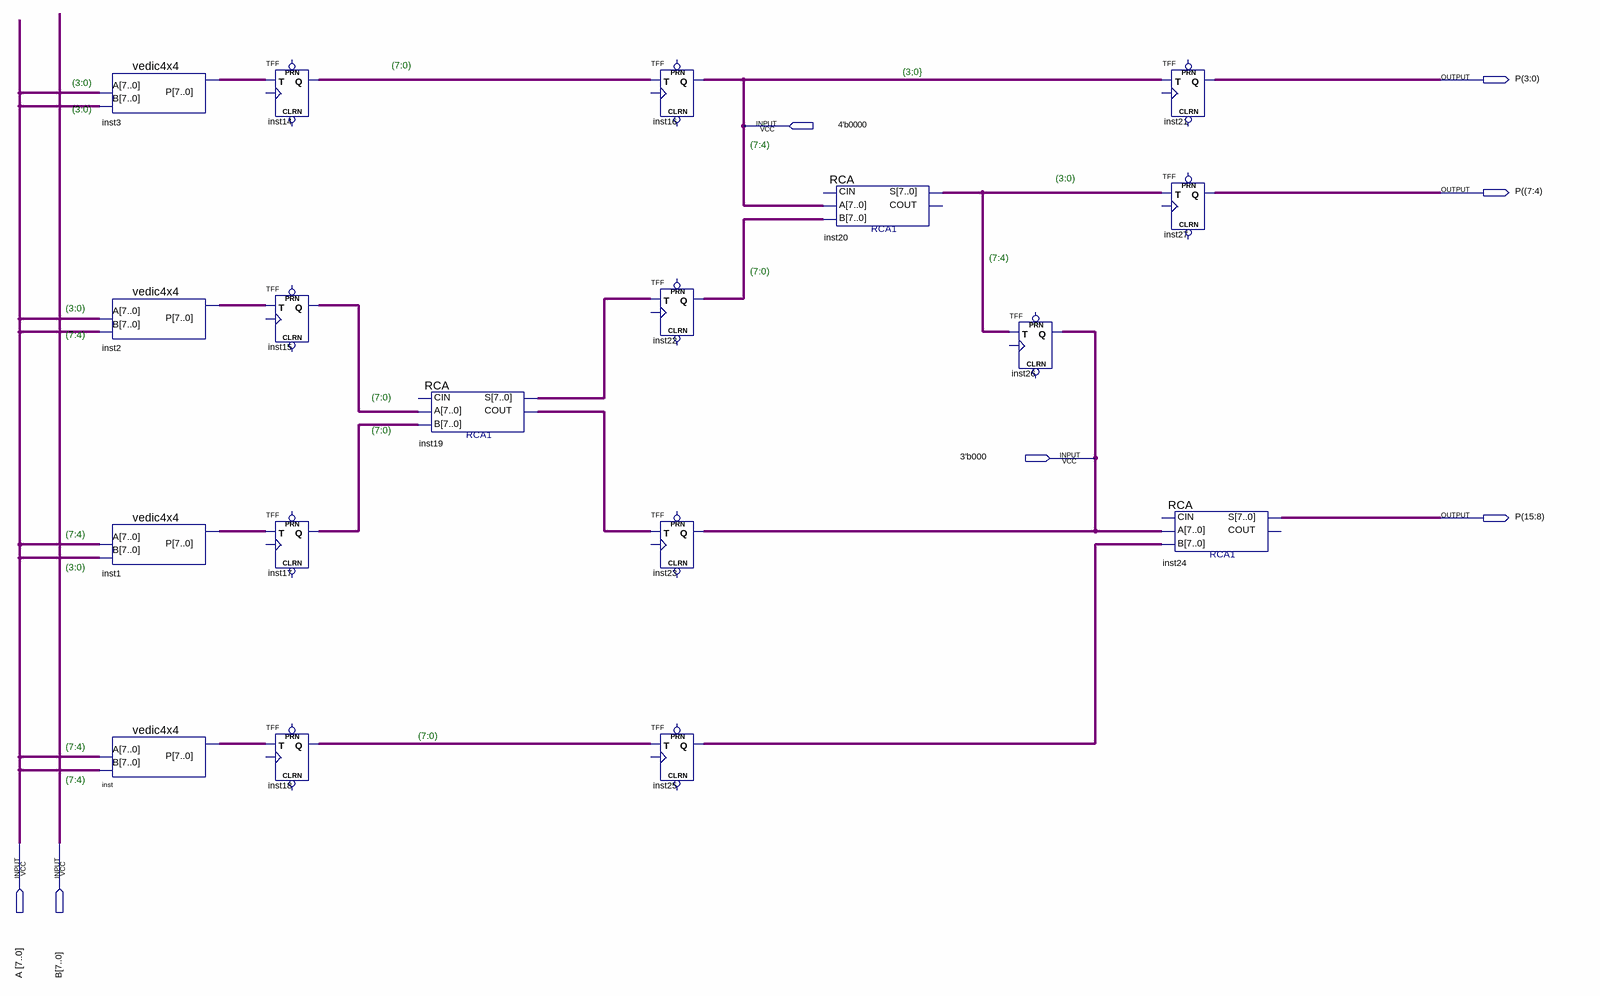
[diagram p0: schematic sheet]
// Quartus schematic schematic top.bdf as structural Verilog: 18 symbols, 7 pins
module \schematic_top  (
  input  \4'b0000 ,
  input  \3'b000 ,
  input  [7:0] A,
  input  [7:0] B,
  output \P(3:0) ,
  output \P((7:4) ,
  output \P(15:8) 
);

  wire [7:0] inst1_sum, inst2_sum, inst3_sum, inst14_q, inst15_q, inst16_q, inst17_q, inst18_q, inst19_cout,
       inst19_sum, inst20_sum, inst21_q, inst22_q, inst23_q, inst24_sum, inst25_q, inst27_q, inst_sum;

  vedic4x4 inst3 (.A(A), .B(A), .SUM(inst3_sum));
  vedic4x4 inst2 (.A(A), .B(A), .SUM(inst2_sum));
  vedic4x4 inst1 (.A(A), .B(A), .SUM(inst1_sum));
  vedic4x4 inst (.A(A), .B(A), .SUM(inst_sum));
  TFF inst14[7:0] (.T(inst3_sum), .Q(inst14_q));  // open: PRN, CLRN, CLK
  TFF inst15[7:0] (.T(inst2_sum), .Q(inst15_q));  // open: PRN, CLRN, CLK
  TFF inst17[7:0] (.T(inst1_sum), .Q(inst17_q));  // open: PRN, CLRN, CLK
  TFF inst18[7:0] (.T(inst_sum), .Q(inst18_q));  // open: PRN, CLRN, CLK
  RCA inst19 (.A(inst15_q), .B(inst17_q), .COUT(inst19_cout), .SUM(inst19_sum));  // open: CIN
  TFF inst16[7:0] (.T(inst14_q), .Q(inst16_q));  // open: PRN, CLRN, CLK
  TFF inst22[7:0] (.T(inst19_sum), .Q(inst22_q));  // open: PRN, CLRN, CLK
  TFF inst23[7:0] (.T(inst19_cout), .Q(inst23_q));  // open: PRN, CLRN, CLK
  TFF inst25[7:0] (.T(inst18_q), .Q(inst25_q));  // open: PRN, CLRN, CLK
  RCA inst20 (.A(inst16_q), .B(inst22_q), .SUM(inst20_sum));  // open: CIN, COUT
  TFF inst26[7:0] (.T(inst20_sum), .Q(inst23_q));  // open: PRN, CLRN, CLK
  TFF inst21[7:0] (.T(inst16_q), .Q(inst21_q));  // open: PRN, CLRN, CLK
  TFF inst27[7:0] (.T(inst20_sum), .Q(inst27_q));  // open: PRN, CLRN, CLK
  RCA inst24 (.A(inst23_q), .B(inst25_q), .SUM(inst24_sum));  // open: CIN, COUT

  // Notes on the sheet:
  //   (7:0)
  //   (3;0}
  //   (3:0)
  //   (3:0)
  //   (7:4)
  //   (3:0)
  //   (7:4)
  //   (7:0)
  //   (3:0)
  //   (7:4)
  //   (7:0)
  //   (7:0)
  //   (7:4)
  //   (3:0)
  //   (7:0)
  //   (7:4)
  //   (7:4)
endmodule
